# Altium project bbr18_wheel_motor_connector_mate_board.PrjPCB
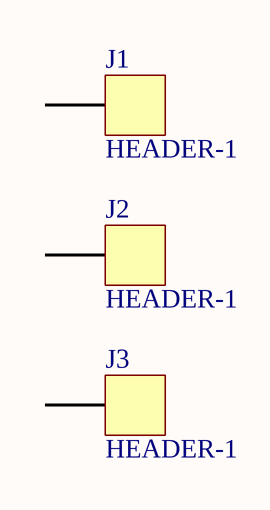
[diagram p0: bbr18_wheel_motor_connector_mate_board.SchDoc]
1 sheet, 3 parts. Net scope: global (net labels, ports and power ports of the same name join across sheets).
Board file: bbr18_wheel_motor_connector_mate_board.PcbDoc

## Sheet bbr18_wheel_motor_connector_mate_board.SchDoc
size A4

### Parts
J1  HEADER-1  [2MM-BANANA-VIA]
J2  HEADER-1  [2MM-BANANA-VIA]
J3  HEADER-1  [2MM-BANANA-VIA]

### Nets

Not connected (* = marked no-connect by the designer): J1 1; J2 1; J3 1